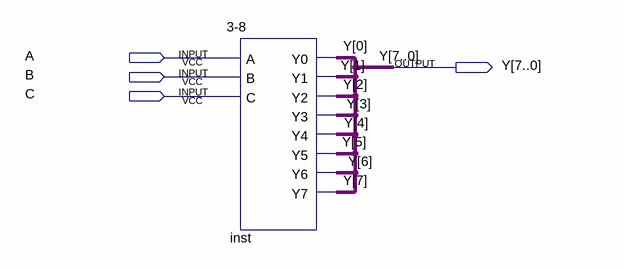
[diagram p0: schematic sheet]
// Quartus schematic 3-8_bus.bdf as structural Verilog: 1 symbols, 4 pins
module \3-8_bus  (
  input  A,
  input  B,
  input  C,
  output [7:0] Y
);

  \3-8  inst (
    .A(A), .B(B), .C(C), .Y0(Y[0]), .Y1(Y[1]), .Y2(Y[2]), .Y3(Y[3]), .Y4(Y[4]), .Y5(Y[5]), .Y6(Y[6]),
    .Y7(Y[7]));
endmodule
